# Altium schematic sheet PLD_FRAM-Memory.SchDoc: Flash Memory
size A4; ApprovedBy: Piotr Kuligowski; CheckedBy: Piotr Kuligowski; Author: Michał Gumiela; SheetNumber: 13; SheetTotal: 13
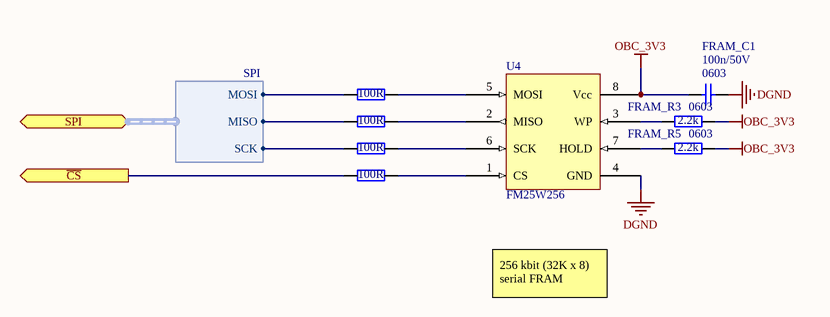
[diagram p0: PLD_FRAM-Memory.SchDoc]

## Parts
FRAM_C1  Package: 0603  [SMD_Capacitor_0603]  (hidden comment: 100n/50V)
FRAM_R1  100R  [SMD_RESISTOR_ARRAY_YC124]  (parts A,B,C,D of 4)
FRAM_R3  Package: 0603  [SMD_Resistor_0603]  (hidden comment: 2.2k)
FRAM_R5  Package: 0603  [SMD_Resistor_0603]  (hidden comment: 2.2k)
U4  FM25W256  [DIP8 ADAPTER]

## Ports
SPI (harness SPI), ~{CS} (out)

## Harnesses
SPI: MISO, MOSI, SCK

## Nets
DGND: FRAM_C1.1 U4.4(GND)
OBC_3V3: FRAM_C1.2 FRAM_R3.2 FRAM_R5.2 U4.8(Vcc)
~{CS}: FRAM_R1.6 ; port ~{CS}
NetFRAM_R1_1: FRAM_R1.1 U4.5(MOSI)
NetFRAM_R1_2: FRAM_R1.2 U4.6(SCK)
NetFRAM_R1_3: FRAM_R1.3 U4.1(CS)
NetFRAM_R1_4: FRAM_R1.4 U4.2(MISO)
NetFRAM_R1_5: FRAM_R1.5 ; port SPI.MISO
NetFRAM_R1_7: FRAM_R1.7 ; port SPI.SCK
NetFRAM_R1_8: FRAM_R1.8 ; port SPI.MOSI
NetFRAM_R3_1: FRAM_R3.1 U4.3(WP)
NetFRAM_R5_1: FRAM_R5.1 U4.7(HOLD)

## Notes on the sheet
- 256 kbit (32K x 8) serial FRAM
- Title:
- Project:
- Author:
- Model:
- Document Number:
- Checked by:
- Rev:
- Date:
- Approved by:
- Sheet:
- of
- File name:

## Library data of the parts
FRAM_C1 = Cer_C0603T104K5RALTU: Ceramic Cap Kemet COTS 100n/50V X7R 0603; Manufacturer: Kemet; ManufacturerPartNumber: C0603T104K5RALTU; Value: 100n/50V
FRAM_R1 = 4ResPack: RESISTOR ARRAY, 4 x 0402; URL: http://pl.farnell.com/yageo-phycomp/yc124-jr-072k2l/resistor-array-arv341-4-x-0402/dp/9235388; value: 100R
FRAM_R3 FRAM_R5 = CRCW06032K20FKxxxx: 2.2k/1% Vishay CRCW 0603 Resistor. 100mW, 100ppm, 75V.; ManufacturerPartNumber: CRCW06032K20FKxxxx; Manufacturer: Vishay; Value: 2.2k
U4 = FM25W256: 256Kb (8k x 32) SPI F-RAM